# EAGLE design fcd-155-breakout (EAGLE 7.7.0)
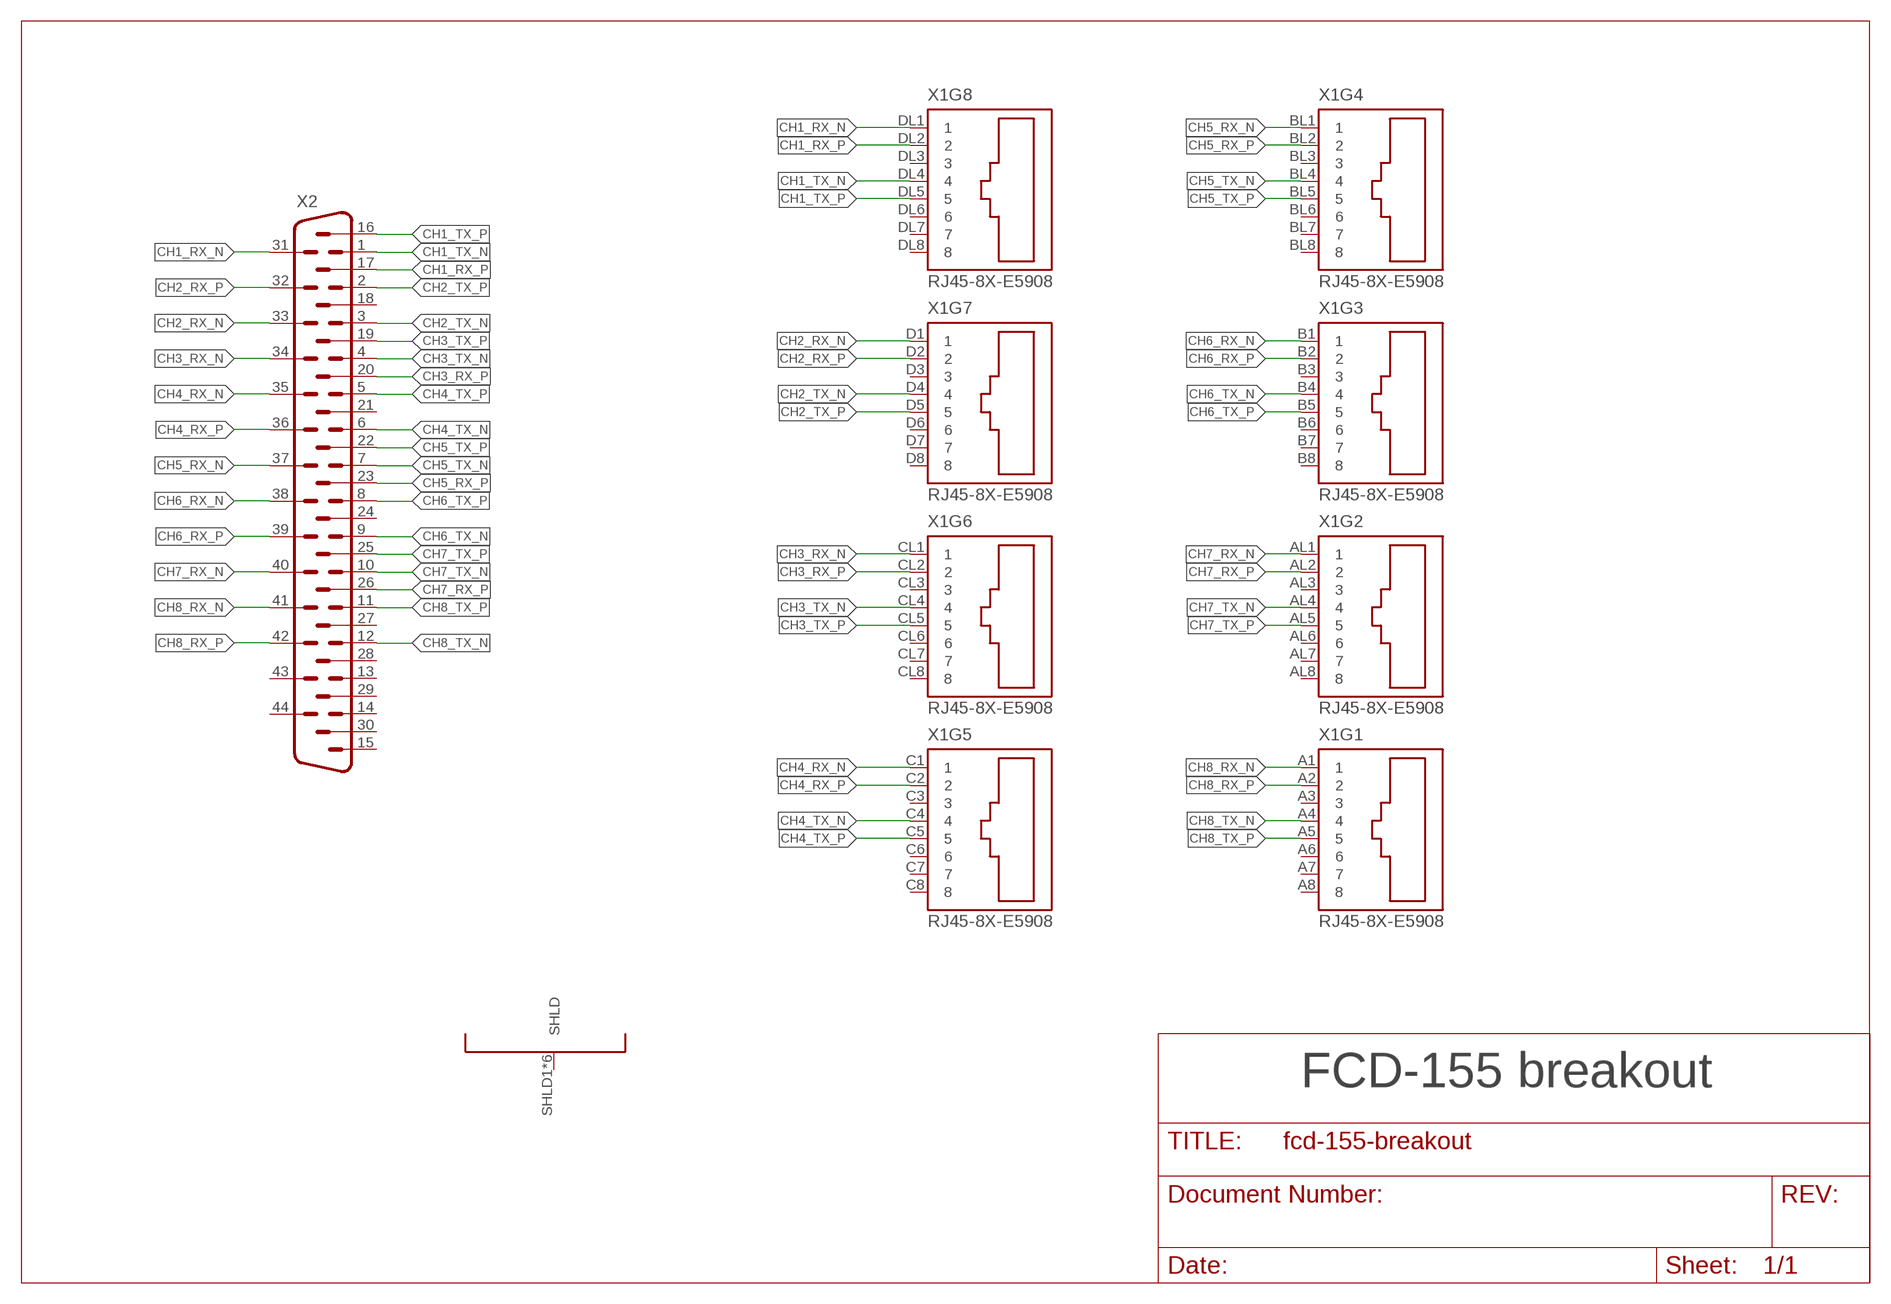
[diagram p0: schematic, sheet 1]

## Parts
X1  RJ45-8X-E5908  [E59078-1VC18X]
X2  HM44H  [HDM44H]

## Nets
CH1_RX_N: X1.DL1 X2.31
CH1_RX_P: X1.DL2 X2.17
CH1_TX_N: X1.DL4 X2.1
CH1_TX_P: X1.DL5 X2.16
CH2_RX_N: X1.D1 X2.33
CH2_RX_P: X1.D2 X2.32
CH2_TX_N: X1.D4 X2.3
CH2_TX_P: X1.D5 X2.2
CH3_RX_N: X1.CL1 X2.34
CH3_RX_P: X1.CL2 X2.20
CH3_TX_N: X1.CL4 X2.4
CH3_TX_P: X1.CL5 X2.19
CH4_RX_N: X1.C1 X2.35
CH4_RX_P: X1.C2 X2.36
CH4_TX_N: X1.C4 X2.6
CH4_TX_P: X1.C5 X2.5
CH5_RX_N: X1.BL1 X2.37
CH5_RX_P: X1.BL2 X2.23
CH5_TX_N: X1.BL4 X2.7
CH5_TX_P: X1.BL5 X2.22
CH6_RX_N: X1.B1 X2.38
CH6_RX_P: X1.B2 X2.39
CH6_TX_N: X1.B4 X2.9
CH6_TX_P: X1.B5 X2.8
CH7_RX_N: X1.AL1 X2.40
CH7_RX_P: X1.AL2 X2.26
CH7_TX_N: X1.AL4 X2.10
CH7_TX_P: X1.AL5 X2.25
CH8_RX_N: X1.A1 X2.41
CH8_RX_P: X1.A2 X2.42
CH8_TX_N: X1.A4 X2.12
CH8_TX_P: X1.A5 X2.11
Unconnected: X1.A3 X1.A6 X1.A7 X1.A8 X1.AL3 X1.AL6 X1.AL7 X1.AL8 X1.B3 X1.B6 X1.B7 X1.B8 X1.BL3 X1.BL6 X1.BL7 X1.BL8 X1.C3 X1.C6 X1.C7 X1.C8 X1.CL3 X1.CL6 X1.CL7 X1.CL8 X1.D3 X1.D6 X1.D7 X1.D8 X1.DL3 X1.DL6 X1.DL7 X1.DL8 X1.SHLD1(SHLD) X1.SHLD2(SHLD) X1.SHLD3(SHLD) X1.SHLD4(SHLD) X1.SHLD5(SHLD) X1.SHLD6(SHLD) X2.13 X2.14 X2.15 X2.18 X2.21 X2.24 X2.27 X2.28 X2.29 X2.30 X2.43 X2.44

## Notes on the sheet
- FCD-155 breakout

## Library data of the parts
X1 = stewart-rj45:RJ45-8X: 8-port RJ45 jack
X2 = con-subd:HM44: SUB-D; OC_FARNELL: unknown; OC_NEWARK: unknown

## Board
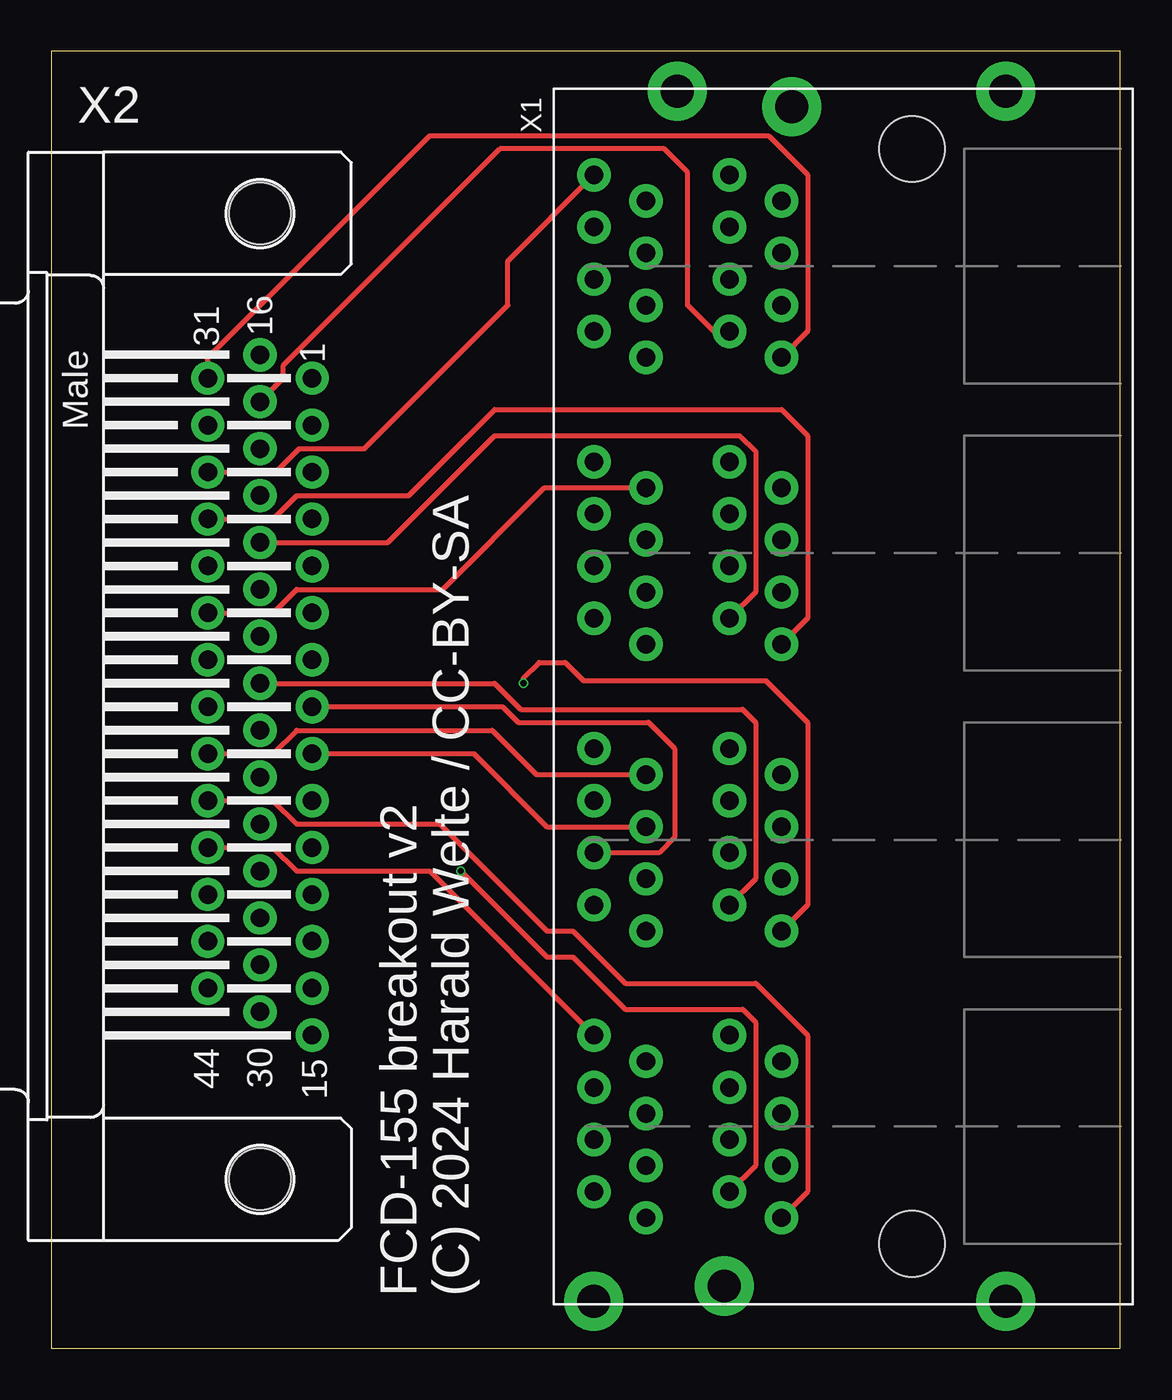
[diagram p1: board, top side]
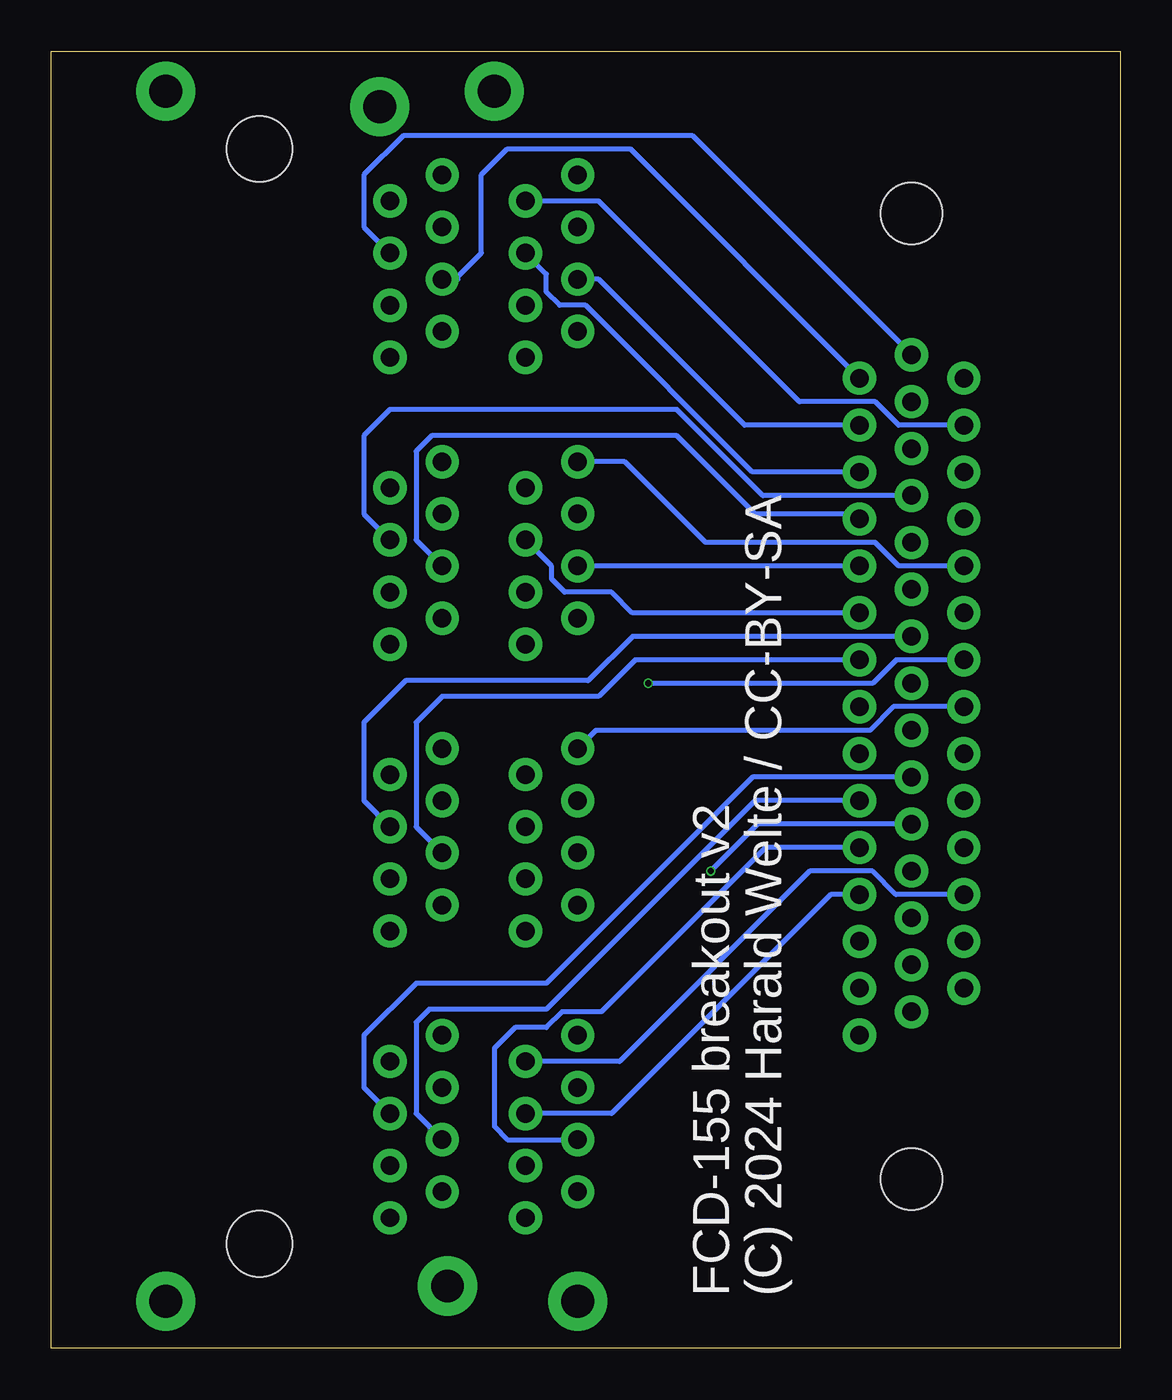
[diagram p2: board, bottom side, seen from below]

Size 52.05 x 63.17 mm. Coordinates in mm from the lower left corner, seen from the top.
Outline: 0,0 52.05,0 52.05,63.17 0,63.17 0,0
Copper layers (1*16): Top 0.035mm / dielectric 1.6mm / Bottom 0.035mm
Design rules "jlcpcb-2layers": minimum track width 5mil, minimum drill 0.3mm, track to track 5mil, track to pad 5mil, pad to pad 5mil, via to via 5mil, smd to smd 5mil, copper to edge 0.2mm, drill to drill 6mil, minimum pad ring 10mil, minimum via ring 3mil, stop-mask expansion 4mil, vias tented up to drill 0mil, thermal gap 10mil

### Footprints (pad centres in the part's own frame; a part is rotated, then mirrored left to right if it is on the bottom)
E59078-1VC18X = drill 0.9: A1 -16.51,11.68; A2 -17.78,9.14; A3 -19.05,11.68; A4 -20.32,9.14; A5 -21.59,11.68; A6 -22.86,9.14; A7 -24.13,11.68; A8 -25.4,9.14; AL1 -25.4,2.54; AL2 -24.13,5.08; AL3 -22.86,2.54; AL4 -21.59,5.08; AL5 -20.32,2.54; AL6 -19.05,5.08; AL7 -17.78,2.54; AL8 -16.51,5.08; B1 -2.54,11.68; B2 -3.81,9.14; B3 -5.08,11.68; B4 -6.35,9.14; B5 -7.62,11.68; B6 -8.89,9.14; B7 -10.16,11.68; B8 -11.43,9.14; BL1 -11.43,2.54; BL2 -10.16,5.08; BL3 -8.89,2.54; BL4 -7.62,5.08; BL5 -6.35,2.54; BL6 -5.08,5.08; BL7 -3.81,2.54; BL8 -2.54,5.08; C1 11.43,11.68; C2 10.16,9.14; C3 8.89,11.68; C4 7.62,9.14; C5 6.35,11.68; C6 5.08,9.14; C7 3.81,11.68; C8 2.54,9.14; CL1 2.54,2.54; CL2 3.81,5.08; CL3 5.08,2.54; CL4 6.35,5.08; CL5 7.62,2.54; CL6 8.89,5.08; CL7 10.16,2.54; CL8 11.43,5.08; D1 25.4,11.68; D2 24.13,9.14; D3 22.86,11.68; D4 21.59,9.14; D5 20.32,11.68; D6 19.05,9.14; D7 17.78,11.68; D8 16.51,9.14; DL1 16.51,2.54; DL2 17.78,5.08; DL3 19.05,2.54; DL4 20.32,5.08; DL5 21.59,2.54; DL6 22.86,5.08; DL7 24.13,2.54; DL8 25.4,5.08 | drill 1.6: SHLD1 29.47,-8.38; SHLD2 28.72,2.04; SHLD3 29.47,7.62; SHLD4 -29.47,-8.38; SHLD5 -28.72,5.34; SHLD6 -29.47,11.69 | hole 3.2: 26.67,-3.81; -26.67,-3.81
HDM44H = drill 0.9: 1 -15.497,2.54; 2 -13.211,2.54; 3 -10.925,2.54; 4 -8.639,2.54; 5 -6.353,2.54; 6 -4.067,2.54; 7 -1.781,2.54; 8 0.505,2.54; 9 2.791,2.54; 10 5.077,2.54; 11 7.363,2.54; 12 9.649,2.54; 13 11.935,2.54; 14 14.221,2.54; 15 16.507,2.54; 16 -16.64,0; 17 -14.354,0; 18 -12.068,0; 19 -9.782,0; 20 -7.496,0; 21 -5.21,0; 22 -2.924,0; 23 -0.638,0; 24 1.648,0; 25 3.934,0; 26 6.22,0; 27 8.506,0; 28 10.792,0; 29 13.078,0; 30 15.364,0; 31 -15.497,-2.54; 32 -13.211,-2.54; 33 -10.925,-2.54; 34 -8.639,-2.54; 35 -6.353,-2.54; 36 -4.067,-2.54; 37 -1.781,-2.54; 38 0.505,-2.54; 39 2.791,-2.54; 40 5.077,-2.54; 41 7.363,-2.54; 42 9.649,-2.54; 43 11.935,-2.54; 44 14.221,-2.54 | hole 3: -23.52,0; 23.52,0

### Placement (x,y rotation side)
X1  38.1,31.75 90 top
X2  10.16,31.75 270 top

### Tracks (layer width: path | path; a pad name or v marks a point on that pad's centre or on a via)
CH1_RX_N
  Top 0.254: X1.DL1 36.83,49.53 36.83,57.15 34.92,59.05 18.41,59.05 7.62,48.26 X2.31
CH1_RX_P
  Top 0.254: X2.17 11.3,47.25 11.3,47.88 21.84,58.42 29.84,58.42 30.99,57.28 30.99,50.8 32.26,49.53 X1.DL2
CH1_TX_N
  Bottom 0.254: X2.1 23.87,58.42 29.84,58.42 31.11,57.15 31.11,53.34 32.26,52.2 32.26,52.07 X1.DL4
CH1_TX_P
  Bottom 0.254: X2.16 20.82,59.05 34.92,59.05 36.83,57.15 36.83,54.61 X1.DL5
CH2_RX_N
  Top 0.254: X2.33 10.93,42.67 12.06,43.81 15.24,43.81 22.23,50.8 22.23,52.95 X1.D1
CH2_RX_P
  Bottom 0.254: X2.32 10.8,44.96 11.94,46.1 15.62,46.1 25.4,55.88 X1.D2
CH2_TX_N
  Bottom 0.254: X2.3 17.91,42.67 26.04,50.8 27.3,50.8 27.94,51.44 27.94,52.32 X1.D4
CH2_TX_P
  Bottom 0.254: X2.2 18.29,44.96 25.4,52.07 X1.D5
CH3_RX_N
  Top 0.254: X2.34 10.8,40.39 11.94,41.53 17.4,41.53 21.59,45.72 35.56,45.72 36.83,44.45 36.83,35.56 X1.CL1
CH3_RX_P
  Top 0.254: X2.20 16.39,39.25 21.59,44.45 33.53,44.45 34.29,43.69 34.29,36.83 X1.CL2
CH3_TX_N
  Bottom 0.254: X2.4 12.95,40.64 17.78,40.64 21.59,44.45 33.53,44.45 34.29,43.69 34.29,39.37 X1.CL4
CH3_TX_P
  Bottom 0.254: X2.19 17.4,41.53 21.59,45.72 35.56,45.72 36.83,44.45 36.83,40.64 X1.CL5
CH4_RX_N
  Bottom 0.254: X2.35 10.8,38.1 11.94,39.24 20.19,39.24 24.13,43.18 X1.C1
CH4_RX_P
  Top 0.254: X2.36 10.8,35.82 11.94,36.96 19.05,36.96 24,41.91 X1.C2
CH4_TX_N
  Bottom 0.254: X2.6 23.75,35.82 24.77,36.83 27.05,36.83 27.69,37.47 27.69,38.1 X1.C4
CH4_TX_P
  Bottom 0.254: X2.5 X1.C5
CH5_RX_N  (via drill 0.3)
  Top 0.254: X1.BL1 36.83,21.59 36.83,30.48 34.8,32.51 25.91,32.51 25.02,33.4 23.75,33.4 22.99,32.64 v22.99,32.38
  Bottom 0.254: X2.37 10.92,33.53 12.06,32.38 v22.99,32.38
CH5_RX_P
  Top 0.254: X2.23 21.59,32.39 22.86,31.11 33.66,31.11 34.29,30.48 34.29,22.86 X1.BL2
CH5_TX_N
  Bottom 0.254: X2.7 23.62,33.53 25.4,31.75 33.02,31.75 34.29,30.48 34.29,25.4 X1.BL4
CH5_TX_P
  Bottom 0.254: X2.22 23.75,34.67 25.91,32.51 34.8,32.51 36.83,30.48 36.83,26.67 X1.BL5
CH6_RX_N
  Bottom 0.254: X2.38 11.05,31.25 12.19,30.1 25.53,30.1 X1.B1
CH6_RX_P
  Top 0.254: X2.39 10.8,28.96 11.94,30.1 21.46,30.1 23.62,27.94 X1.B2
CH6_TX_N
  Top 0.254: X2.9 20.57,28.96 24.13,25.4 X1.B4
CH6_TX_P
  Top 0.254: X2.8 21.97,31.25 22.73,30.48 29.08,30.48 30.35,29.21 30.35,24.89 29.59,24.13 X1.B5
CH7_RX_N
  Top 0.254: X2.40 10.79,26.67 11.94,25.53 18.92,25.53 24.13,20.32 25.4,20.32 27.94,17.78 34.29,17.78 36.83,15.24 36.83,7.62 X1.AL1
CH7_RX_P  (via drill 0.3)
  Top 0.254: X1.AL2 34.29,8.89 34.29,15.88 33.66,16.51 27.94,16.51 25.4,19.05 24.13,19.05 20.64,22.54 v19.94,23.24
  Bottom 0.254: X2.26 17.65,25.53 v19.94,23.24
CH7_TX_N
  Bottom 0.254: X2.10 17.78,26.67 27.94,16.51 33.66,16.51 34.29,15.88 34.29,11.43 X1.AL4
CH7_TX_P
  Bottom 0.254: X2.25 17.9,27.82 27.94,17.78 34.29,17.78 36.83,15.24 36.83,12.7 X1.AL5
CH8_RX_N
  Top 0.254: X2.41 10.79,24.39 11.94,23.24 18.42,23.24 X1.A1
CH8_RX_P
  Bottom 0.254: X1.A2 24.38,13.97 15.11,23.24 12.06,23.24 10.93,22.1 X2.42
CH8_TX_N
  Bottom 0.254: X2.12 14.09,22.1 24.77,11.43 X1.A4
CH8_TX_P
  Bottom 0.254: X2.11 17.27,24.39 25.27,16.38 27.18,16.38 27.94,15.62 29.46,15.62 30.48,14.61 30.48,10.79 29.84,10.16 X1.A5

### Text on the board
tNames: FCD-155 breakout v2 | (C) 2024 Harald Welte / CC-BY-SA
bNames: (C) 2024 Harald Welte / CC-BY-SA | FCD-155 breakout v2